# EAGLE design PCBMotores (EAGLE 7.6.0)
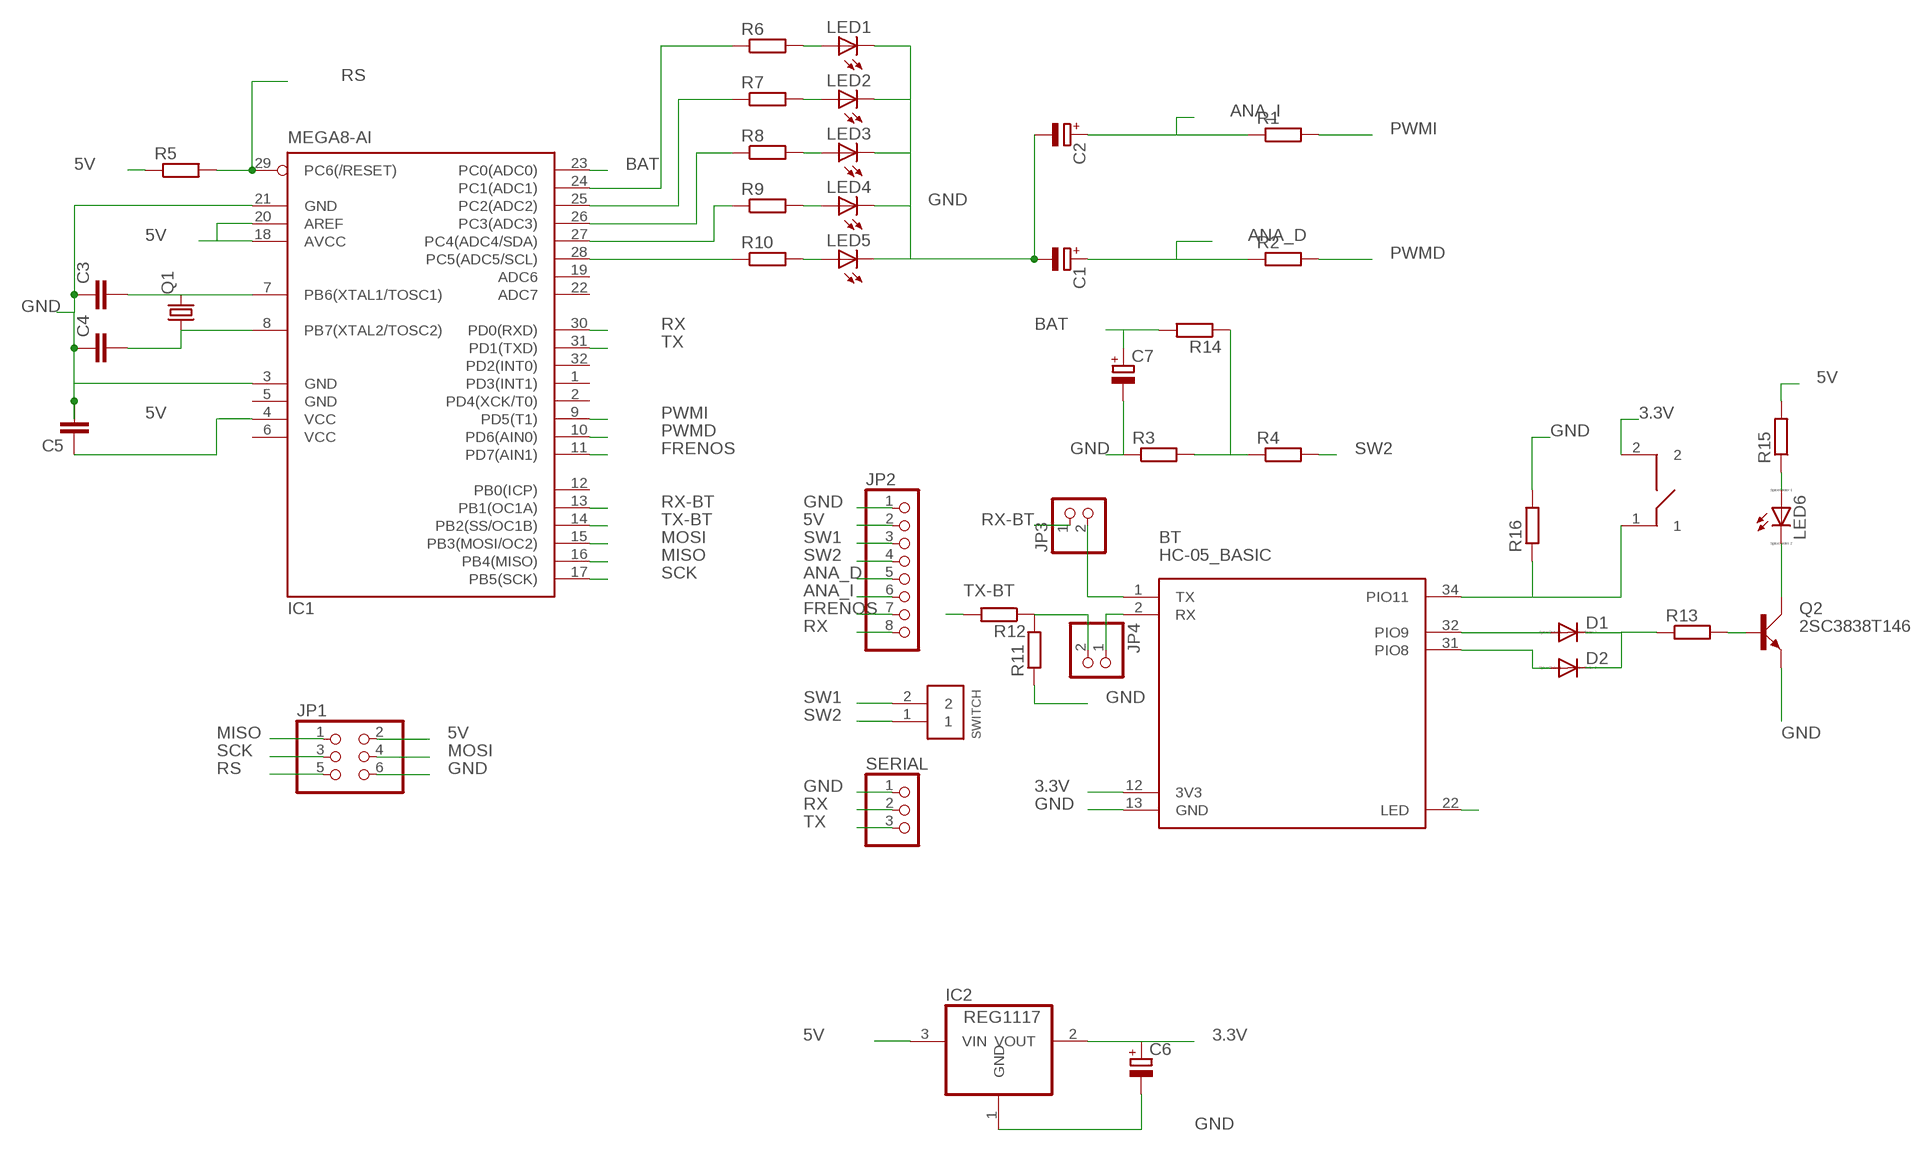
[diagram p0: schematic, sheet 1]

## Parts
BT  HC-05_BASIC  [BLUETOOTH_SMD]
C1  CPOL-EU153CLV-0505  [153CLV-0505]
C2  CPOL-EU153CLV-0505  [153CLV-0505]
C3  C-EUC0402K  [C0402K]
C4  C-EUC0402K  [C0402K]
C5  C-EUC0402K  [C0402K]
C6  CPOL-EU153CLV-0505  [153CLV-0505]
C7  CPOL-EU153CLV-0505  [153CLV-0505]
D1  DIODE-DO-214AC  [DO-214AC]
D2  DIODE-DO-214AC  [DO-214AC]
IC1  MEGA8-AI  [TQFP32-08]
IC2  REG1117  [SOT223]
JP1  PINHD-2X3  [2X03]
JP2  PINHD-1X8  [1X08]
JP3  PINHD-1X2  [1X02]
JP4  PINHD-1X2  [1X02]
LED1  LED5MM  [LED5MM]
LED2  LED5MM  [LED5MM]
LED3  LED5MM  [LED5MM]
LED4  LED5MM  [LED5MM]
LED5  LED5MM  [LED5MM]
LED6  LED_ESML0603  [LED_SML0603]
Q1  CRYSTALHC49S  [HC49/S]
Q2  2SC3838T146  [SC59]
R1  R-EU_M1206  [M1206]
R2  R-EU_M1206  [M1206]
R3  R-EU_M1206  [M1206]
R4  R-EU_M1206  [M1206]
R5  R-EU_M1206  [M1206]
R6  R-EU_M1206  [M1206]
R7  R-EU_M1206  [M1206]
R8  R-EU_M1206  [M1206]
R9  R-EU_M1206  [M1206]
R10  R-EU_M1206  [M1206]
R11  R-EU_M1206  [M1206]
R12  R-EU_M1206  [M1206]
R13  R-EU_M1206  [M1206]
R14  R-EU_M1206  [M1206]
R15  R-EU_M1206  [M1206]
R16  R-EU_M1206  [M1206]
SERIAL  PINHD-1X3  [1X03]
SWITCH  CP150_1X2  [CP150_1X2]
U$2  PUSH_SMD  [PUSH_SMD]

## Nets
3.3V: BT.12(3V3) C6.+ IC2.2(VOUT) U$2.2
5V: C5.1 IC1.4(VCC) IC1.18(AVCC) IC1.20(AREF) IC2.3(VIN) JP1.2 JP2.2 R5.1 R15.2
ANA_D: C1.+ JP2.5 R2.1
ANA_I: C2.+ JP2.6 R1.1
BAT: C7.+ IC1.23(PC0(ADC0)) R14.2
FRENOS: IC1.11(PD7(AIN1)) JP2.7
GND: BT.13(GND) C1.- C2.- C3.1 C4.1 C5.2 C6.- C7.- IC1.3(GND) IC1.21(GND) IC2.1(GND) JP1.6 JP2.1 LED1.K(C) LED2.K(C) LED3.K(C) LED4.K(C) LED5.K(C) Q2.E R3.1 R11.1 R16.2 SERIAL.1
MISO: IC1.16(PB4(MISO)) JP1.1
MOSI: IC1.15(PB3(MOSI/OC2)) JP1.4
N$3: IC1.28(PC5(ADC5/SCL)) R10.1
N$4: IC1.27(PC4(ADC4/SDA)) R9.1
N$5: IC1.26(PC3(ADC3)) R8.1
N$6: C4.2 IC1.8(PB7(XTAL2/TOSC2)) Q1.1
N$7: C3.2 IC1.7(PB6(XTAL1/TOSC1)) Q1.2
N$8: IC1.25(PC2(ADC2)) R7.1
N$9: IC1.24(PC1(ADC1)) R6.1
N$10: LED1.A R6.2
N$11: LED2.A R7.2
N$12: LED3.A R8.2
N$13: LED4.A R9.2
N$14: LED5.A R10.2
N$15: D1.C D2.C R13.1
N$16: Q2.B R13.2
N$17: BT.34(PIO11) R16.1 U$2.1
N$18: BT.32(PIO9) D1.A
N$19: BT.31(PIO8) D2.A
N$20: BT.22(LED)
N$21: LED6.A R15.1
N$22: LED6.C Q2.C
N$23: JP4.2 R11.2 R12.1
N$24: BT.1(TX) JP3.2
N$25: BT.2(RX) JP4.1
N$26: R3.2 R4.1 R14.1
PWMD: IC1.10(PD6(AIN0)) R2.2
PWMI: IC1.9(PD5(T1)) R1.2
RS: IC1.29(PC6(/RESET)) JP1.5 R5.2
RX: IC1.30(PD0(RXD)) JP2.8 SERIAL.2
RX-BT: IC1.13(PB1(OC1A)) JP3.1
SCK: IC1.17(PB5(SCK)) JP1.3
SW1: JP2.3 SWITCH.2
SW2: JP2.4 R4.2 SWITCH.1
TX: IC1.31(PD1(TXD)) SERIAL.3
TX-BT: IC1.14(PB2(SS/OC1B)) R12.2
Unconnected: IC1.1(PD3(INT1)) IC1.2(PD4(XCK/T0)) IC1.12(PB0(ICP)) IC1.19(ADC6) IC1.22(ADC7) IC1.32(PD2(INT0))

## Power pins joined to a net without a drawn wire
GND: IC1.5(GND)
VCC: IC1.6(VCC)

## Library data of the parts
BT = hc05-own:HC-05_BASIC
C1 C2 C6 C7 = rcl:CPOL-EU: POLARIZED CAPACITOR, European symbol
C3-C5 = rcl:C-EU: CAPACITOR, European symbol
D1 D2 = diode:DIODE-: DIODE
IC1 = atmel:MEGA8: MICROCONTROLLER 8 Kbytes FLASH, 1 kbytes SRAM, 512 bytes EEPROM, USART, 6-channel 10 bit ADC, 2-channel 8 bit ADC Pin compatible with Atmega48, ATMega88, ATMega168 Source: avr.lbr; MPN: ATMEGA8-16AU; OC_FARNELL: 9171371; OC_NEWARK: 73M8863
IC2 = burr-brown:REG1117: 800mA and 1A Low Dropout (LDO) Positive Regulator 1.8V, 2.5V, 2.85V, 3.3V, 5V, and Adj; MPN: REG1117; OC_FARNELL: 1097566; OC_NEWARK: 14P6981
JP1 = pinhead:PINHD-2X3: PIN HEADER
JP2 = pinhead:PINHD-1X8: PIN HEADER
JP3 JP4 = pinhead:PINHD-1X2: PIN HEADER
LED1-LED5 = led:LED: LED OSRAM: - CHIPLED LG R971, LG N971, LY N971, LG Q971, LY Q971, LO R971, LY R971 LH N974, LH R974 LS Q976, LO Q976, LY Q976 LO Q996 - Hyper CHIPLED LW Q18S LB Q993, LB Q99A, LB R99A - SideLED LS A670, LO A670, LY A670, LG A670, LP A670 LB A673, LV A673, LT A673, LW A673 LH A674 LY A675 LS A676, LA A676, LO A676, LY A676, LW A676 LS A679, LY A679, LG A679 - Hyper Micro SIDELED® LS Y876, LA Y876, LO Y876, LY Y876 LT Y87S - SmartLED LW L88C, LW L88S LB L89C, LB L89S, LG L890 LS L89K, LO L89K, LY L89K LS L896, LA L896, LO L896, LY L896 - TOPLED LS T670, LO T670, LY T670, LG T670, LP T670 LSG T670, LSP T670, LSY T670, LOP T670, LYG T670 LG T671, LOG T671, LSG T671 LB T673, LV T673, LT T673, LW T673 LH T674 LS T676, LA T676, LO T676, LY T676, LB T676, LH T676, LSB T676, LW T676 LB T67C, LV T67C, LT T67C, LS T67K, LO T67K, LY T67K, LW E67C LS E67B, LA E67B, LO E67B, LY E67B, LB E67C, LV E67C, LT E67C LW T67C LS T679, LY T679, LG T679 LS T770, LO T770, LY T770, LG T770, LP T770 LB T773, LV T773, LT T773, LW T773 LH T774 LS E675, LA E675, LY E675, LS T675 LS T776, LA T776, LO T776, LY T776, LB T776 LHGB T686 LT T68C, LB T68C - Hyper Mini TOPLED® LB M676 - Mini TOPLED Santana® LG M470 LS M47K, LO M47K, LY M47K Source: http://www.osram.convergy.de LUXEON: - LUMILED® LXK2-PW12-R00, LXK2-PW12-S00, LXK2-PW14-U00, LXK2-PW14-V00 LXK2-PM12-R00, LXK2-PM12-S00, LXK2-PM14-U00 LXK2-PE12-Q00, LXK2-PE12-R00, LXK2-PE12-S00, LXK2-PE14-T00, LXK2-PE14-U00 LXK2-PB12-K00, LXK2-PB12-L00, LXK2-PB12-M00, LXK2-PB14-N00, LXK2-PB14-P00, LXK2-PB14-Q00 LXK2-PR12-L00, LXK2-PR12-M00, LXK2-PR14-Q00, LXK2-PR14-R00 LXK2-PD12-Q00, LXK2-PD12-R00, LXK2-PD12-S00 LXK2-PH12-R00, LXK2-PH12-S00 LXK2-PL12-P00, LXK2-PL12-Q00, LXK2-PL12-R00 Source: www.luxeon.com KINGBRIGHT: KA-3528ASYC Source: www.kingbright.com
LED6 = eagle-ltspice:LED_E: LED Source: http://www.osram.convergy.de Source: www.luxeon.com Source: www.kingbright.com; SPICEMODEL: NONE; SPICEPREFIX: D; SPICETYPE: diode
Q1 = crystal:CRYSTAL: CRYSTAL; OC_FARNELL: 1667008; OC_NEWARK: unknown
Q2 = transistor-small-signal:2SC3838: High-Frequency Amplifier Transistor 11V, 50mA, 3.2GHz (Rohm)
R1-R16 = resistor:R-EU_: RESISTOR, European symbol
SERIAL = pinhead:PINHD-1X3: PIN HEADER
SWITCH = cp150:CP150_1X2
U$2 = push:PUSH_SMD

## Board
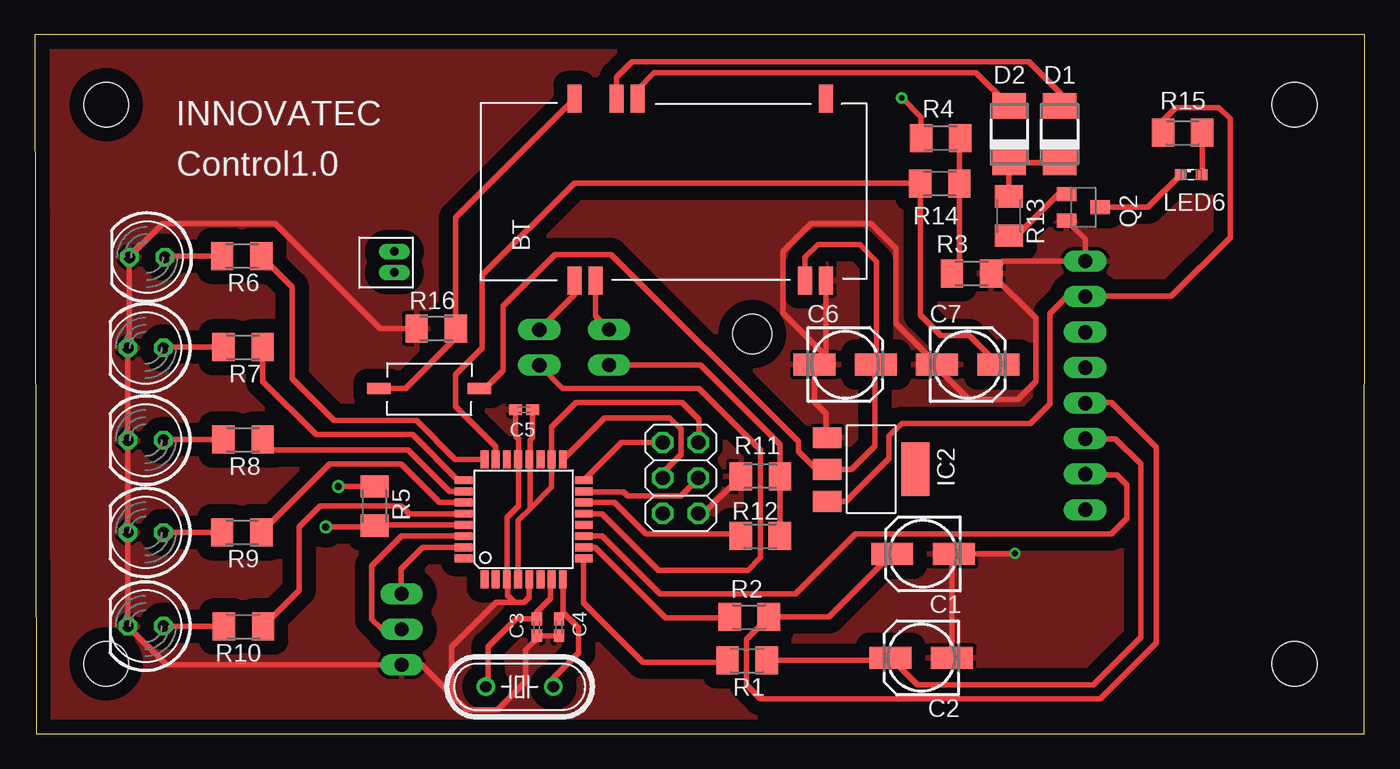
[diagram p1: board, top side]
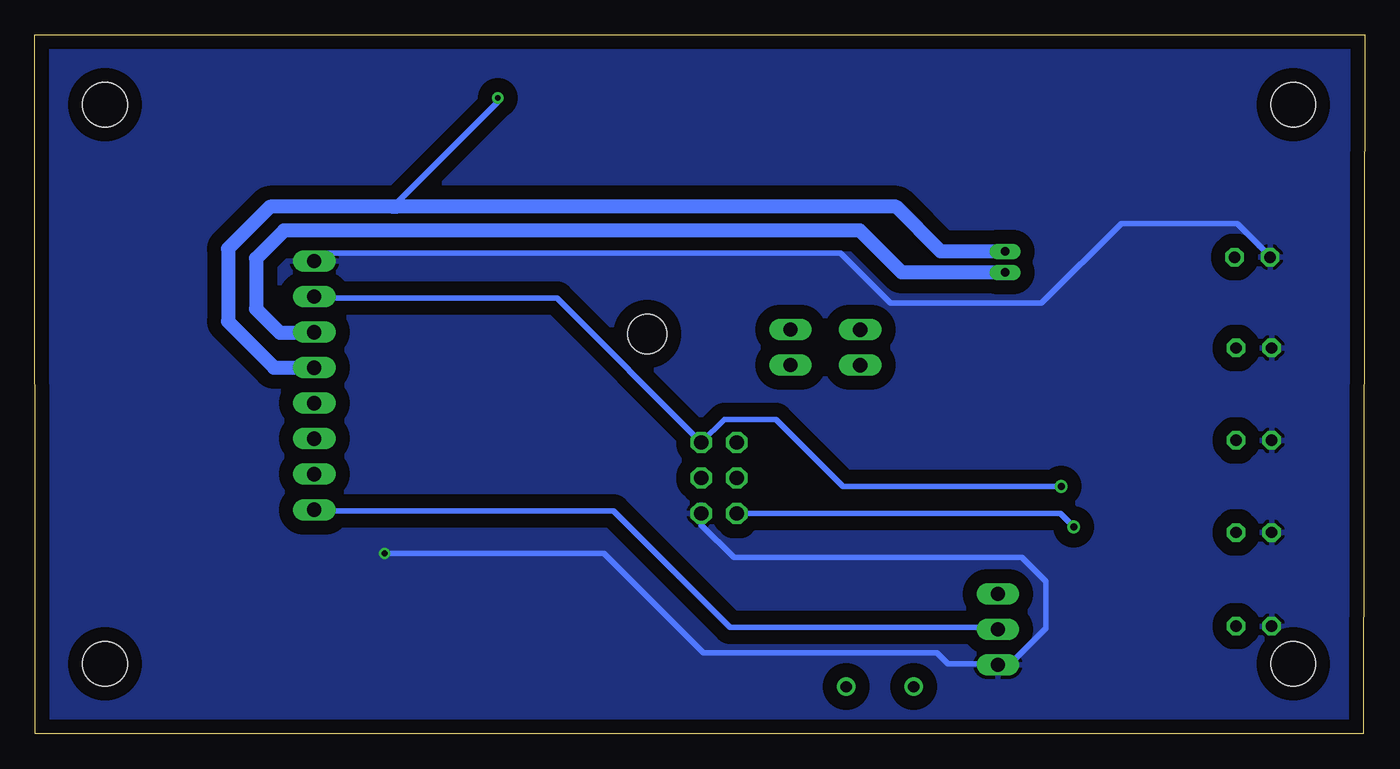
[diagram p2: board, bottom side, seen from below]

Size 95.11 x 50.01 mm. Coordinates in mm from the lower left corner, seen from the top.
Outline: 0.08,0 95.09,0 95.11,50.01 0,50.01 0.08,0
Copper layers (1*16): Top 0.035mm / dielectric 1.5mm / Bottom 0.035mm
Design rules "default": minimum track width 10mil, minimum drill 24mil, track to track 8mil, track to pad 8mil, pad to pad 8mil, via to via 8mil, smd to smd 8mil, copper to edge 40mil, drill to drill 8mil, minimum pad ring 10mil, minimum via ring 8mil, stop-mask expansion 4mil, vias tented up to drill 0mil, thermal gap 10mil
Holes 3.2 mm at 5.1,45.01 5.1,5.01 90.1,5.01 90.1,45.01
Holes 2.8 mm at 51.3,28.61

### Footprints (pad centres in the part's own frame; a part is rotated, then mirrored left to right if it is on the bottom)
BLUETOOTH_SMD = smd 2 x 1: 1 -6.35,3.81; 2 -6.35,2.31; 12 -6.35,-12.69; 13 -6.35,-14.19; 22 6.66,-14.19; 31 6.65,-0.69; 32 6.65,0.81; 34 6.65,3.81
153CLV-0505 = smd 3 x 1.6: + 2.2,0; - -2.2,0
C0402K = smd 0.925 x 0.74: 1 -0.6,0; 2 0.6,0
DO-214AC = smd 1.8 x 2.4: A 2.025,0; C -2.025,0
TQFP32-08 = smd 1.27 x 0.559: 1 -4.293,2.8; 2 -4.293,2; 3 -4.293,1.2; 4 -4.293,0.4; 5 -4.293,-0.4; 6 -4.293,-1.2; 7 -4.293,-2; 8 -4.293,-2.8; 17 4.293,-2.8; 18 4.293,-2; 19 4.293,-1.2; 20 4.293,-0.4; 21 4.293,0.4; 22 4.293,1.2; 23 4.293,2; 24 4.293,2.8 | smd 0.559 x 1.27: 9 -2.8,-4.293; 10 -2,-4.293; 11 -1.2,-4.293; 12 -0.4,-4.293; 13 0.4,-4.293; 14 1.2,-4.293; 15 2,-4.293; 16 2.8,-4.293; 25 2.8,4.293; 26 2,4.293; 27 1.2,4.293; 28 0.4,4.293; 29 -0.4,4.293; 30 -1.2,4.293; 31 -2,4.293; 32 -2.8,4.293
SOT223 = smd 1.499 x 2.007: 1 -2.261,-3.15; 2 0.025,-3.15; 3 2.311,-3.15 | smd 3.81 x 2.007: 4 0,3.15
2X03 = drill 1.016 octagon: 1 -2.54,-1.27; 2 -2.54,1.27; 3 0,-1.27; 4 0,1.27; 5 2.54,-1.27; 6 2.54,1.27
1X08 = drill 1.016 long: 1 -8.89,0; 2 -6.35,0; 3 -3.81,0; 4 -1.27,0; 5 1.27,0; 6 3.81,0; 7 6.35,0; 8 8.89,0
1X02 = drill 1.016 long: 1 -1.27,0; 2 1.27,0
LED5MM = drill 0.813 octagon: A -1.27,0; K 1.27,0
LED_SML0603 = smd 0.8 x 0.8: A 0.75,0; C -0.75,0
HC49/S = drill 0.813: 1 -2.413,0; 2 2.413,0
SC59 = smd 1 x 1.4: B -0.95,-1.2; C 0,1.2; E 0.95,-1.2
M1206 = smd 1.6 x 2: 1 -1.4,0; 2 1.4,0
1X03 = drill 1.016 long: 1 -2.54,0; 2 0,0; 3 2.54,0
CP150_1X2 = drill 0.6 long: 1 -0.5,0; 2 1,0
PUSH_SMD = smd 1.676 x 0.813: 1 -3.4,-0.1; 2 3.8,-0.1

### Placement (x,y rotation side)
BT  42.4,38.79 90 top
C1  63.52,12.88 180 top
C2  63.4,5.44 180 top
C3  35.89,7.63 90 top
C4  37.49,7.63 90 top
C5  34.98,23.2 180 top
C6  57.96,26.43 0 top
C7  66.72,26.43 0 top
D1  73.3,42.91 90 top
D2  69.7,42.91 90 top
IC1  34.96,15.35 90 top
IC2  59.82,18.93 270 top
JP1  46.18,18.31 270 top
JP2  75.13,24.93 270 top
JP3  36.08,27.65 90 top
JP4  41.07,27.66 270 top
LED1  8.02,34.11 180 top
LED2  7.92,27.61 180 top
LED3  7.92,21.01 180 top
LED4  7.92,14.41 180 top
LED5  7.92,7.71 180 top
LED6  82.7,40.01 0 top
Q1  34.67,3.37 180 top
Q2  74.99,37.68 270 top
R1  50.94,5.25 180 top
R2  51.09,8.37 180 top
R3  66.99,32.95 180 top
R4  64.79,42.63 180 top
R5  24.3,16.3 270 top
R6  14.79,34.19 180 top
R7  14.89,27.67 180 top
R8  14.89,21.05 180 top
R9  14.79,14.43 180 top
R10  14.92,7.69 180 top
R11  51.89,18.43 0 top
R12  51.88,14.15 180 top
R13  69.67,37.05 270 top
R14  64.73,39.38 180 top
R15  82.1,43.01 180 top
R16  28.7,29.01 180 top
SERIAL  26.23,7.48 90 top
SWITCH  25.72,34.02 270 top
U$2  28,24.81 0 top

### Tracks (layer width: path | path; a pad name or v marks a point on that pad's centre or on a via)
3.3V
  Top 0.406: BT.12 55.09,34.1 56,35.01 59,35.01 60.2,33.81 60.2,26.47 C6.+ 60.1,26.37 60.1,20.61 58.4,18.91 IC2.2 56.58,18.81 56,18.81 54.6,20.21 54.6,20.91 41.2,34.31 37.2,34.31 33.5,30.61 33.5,26.01 32.2,24.71 U$2.2
5V  (via drill 0.5)
  Top 0.406: IC1.4 34.56,15.27 35.4,16.11 | 35.4,16.11 35.4,19.6 IC1.20 35.4,19.68 35.4,21.01 35.58,21.19 C5.1 | 35.4,16.11 36.96,17.67 IC1.18 36.96,21.97 38.7,23.71 46.3,23.71 47.5,22.51 47.5,20.9 JP1.2 | R5.1 v21.71,17.7 v21.7,17.71 | IC2.3 58.01,16.62 61.1,19.71 61.1,21.31 62,22.21 71.2,22.21 72.6,23.61 72.6,30.08 73.7,31.18 75.03,31.18 JP2.2 | 74.5,31.21 75.06,31.21 JP2.2 | R15.2 80.7,43.91 81.6,44.81 84.7,44.81 85.5,44.01 85.5,35.51 81.3,31.31 75.16,31.31 JP2.2
  Bottom 0.406: v21.7,17.71 37.3,17.71 42.1,22.51 45.79,22.51 JP1.2 57.78,31.18 75.03,31.18 JP2.2
ANA_D
  Top 0.406: C1.+ 56.81,8.37 R2.1 50.9,6.78 50.9,3.51 51.9,2.51 76.2,2.51 80.2,6.51 80.2,20.51 77,23.71 75.18,23.71 JP2.5
ANA_I
  Top 0.406: R1.1 61.01,5.25 C2.+ 63.13,3.51 75.7,3.51 79.1,6.91 79.1,19.31 77.3,21.11 JP2.6
BAT
  Top 0.406: IC1.23 32.96,20.55 30.1,23.41 30.1,25.71 32,27.61 32,32.81 38.6,39.41 63.3,39.41 R14.2 63.33,29.98 64.8,28.51 66.84,28.51 C7.+
FRENOS
  Top 0.406: IC1.11 40.56,14.15 44.7,10.01 54.4,10.01 58.7,14.31 77,14.31 78.1,15.41 78.1,17.81 77.4,18.51 75.2,18.51 JP2.7
GND  (via drill 0.4)
  Top 0.406: IC1.5 35.36,9.77 35,9.41 34.3,9.41 | 34.3,9.41 33.8,9.91 33.8,11.02 IC1.3 33.76,15.47 34.6,16.31 34.6,19.6 IC1.21 34.6,19.68 34.6,21.11 34.38,21.33 C5.2 | C3.1 C4.1 36.12,7.03 35.1,6.01 35.1,3.71 33.1,1.71 30.9,1.71 29.8,2.81 | 29.8,2.81 29.8,6.21 33,9.41 34.3,9.41 | 29.8,2.81 27.67,4.94 SERIAL.1 9.42,4.94 LED5.K LED4.K LED3.K LED2.K 6.75,27.71 LED1.K 9.15,36.51 17.2,36.51 24.7,29.01 R16.2 | IC2.1 56.6,21.26 56.6,22.91 55.76,23.75 C6.- 56.47,27.14 | C2.- 65.6,12.76 C1.- 70.07,12.88 v70.1,12.91 | 56.47,27.14 56.59,27.26 BT.13 56.59,30.1 | JP1.6 47.83,15.77 R11.1 | Q2.E 75.13,35.39 JP2.1 69.26,33.82 R3.1 71.6,29.74 71.6,25.21 70.3,23.91 66.8,23.91 64.8,25.91 64.8,26.71 C7.- 61.6,29.35 61.6,34.71 59.8,36.51 55.5,36.51 53.5,34.51 53.5,30.11 56.47,27.14
  Bottom 0.406: JP1.6 47.45,14.96 45.1,12.61 24.5,12.61 22.8,10.91 22.8,7.54 25.4,4.94 SERIAL.1 26.3,5.01 29.8,5.01 30.6,5.81 47.3,5.81 54.4,12.91 v70.1,12.91 | LED1.K 6.75,34.16 9.1,36.51 17.4,36.51 23.1,30.81 33.9,30.81 37.5,34.41 74.54,34.41 JP2.1 74.64,34.31
  pour Bottom (isolate 1): 0.2,50.11 101.2,50.31 101.2,-0.49 0.3,-0.59
  pour Top (isolate 1): 0.9,50.01 102.3,49.81 102.3,-0.29 0.8,-0.29
MISO
  Top 0.406: JP1.1 41.95,20.85 IC1.16
MOSI
  Top 0.406: JP1.4 47.45,18.26 46.2,17.01 42.4,17.01 42.1,17.31 39.29,17.31 IC1.15
N$3
  Top 0.406: IC1.28 26.76,15.75 26.2,16.31 20.4,16.31 18.9,14.81 18.9,10.27 R10.1 16.34,7.71
N$4
  Top 0.406: IC1.27 28.96,16.55 26.2,19.31 21.07,19.31 R9.1
N$5
  Top 0.406: IC1.26 29.66,17.35 26.7,20.31 17.03,20.31 R8.1
N$6
  Top 0.406: IC1.8 37.76,8.71 | 37.76,8.71 37.76,8.5 C4.2 | Q1.1 37.08,3.99 38.9,5.81 38.9,7.57 37.76,8.71
N$7
  Top 0.406: IC1.7 36.9,11 36.9,9.71 35.89,8.7 C3.2 34.42,8.23 32.4,6.21 32.4,3.51 Q1.2
N$8
  Top 0.406: IC1.25 30.26,18.15 27,21.41 20.1,21.41 16.3,25.21 R7.1
N$9
  Top 0.406: IC1.24 30.07,19.64 27.3,22.41 21.4,22.41 18.4,25.41 18.4,31.98 R6.1
N$10
  Top 0.406: R6.2 9.37,34.19 LED1.A
N$11
  Top 0.406: R7.2 9.25,27.67 LED2.A
N$12
  Top 0.406: R8.2 9.23,21.05 LED3.A
N$13
  Top 0.406: R9.2 9.21,14.43 LED4.A
N$14
  Top 0.406: R10.2 9.21,7.69 LED5.A
N$15
  Top 0.406: R13.1 69.67,40.85 D2.C D1.C
N$16
  Top 0.406: Q2.B 73.22,38.63 70.2,35.61 69.71,35.61 R13.2
N$17
  Top 0.406: BT.34 30.1,36.95 R16.1 30.1,28.31 26.5,24.71 U$2.1
N$18
  Top 0.406: BT.32 41.59,47 42.7,48.11 71.1,48.11 73.4,45.81 73.4,45.03 D1.A
N$19
  Top 0.406: BT.31 43.09,46.1 44.3,47.31 67.32,47.31 D2.A
N$21
  Top 0.406: R15.1 83.5,40.06 LED6.A
N$22
  Top 0.406: Q2.C 79.62,37.68 LED6.C
N$23
  Top 0.406: R12.1 R11.2 53.3,20.71 47.62,26.39 JP4.2
N$24
  Top 0.406: BT.1 38.59,31.43 JP3.2
N$25
  Top 0.406: BT.2 40.09,29.91 JP4.1
N$26
  Top 0.406: R4.1 66.13,42.57 R14.1 66.13,33.49 R3.2
PWMD
  Top 0.406: IC1.10 40.06,13.35 45.1,8.31 49.63,8.31 R2.2
PWMI
  Top 0.406: IC1.9 39.25,9.36 43.5,5.11 49.4,5.11 R1.2
RS  (via drill 0.5)
  Top 0.406: IC1.29 24.35,14.95 R5.2 24.21,14.81 v20.8,14.81
  Bottom 0.406: JP1.5 21.76,15.77 v20.8,14.81
RX
  Top 0.406: IC1.30 26.24,14.15 24.1,12.01 24.1,8.21 24.8,7.51 26.2,7.51 SERIAL.2
  Bottom 0.406: SERIAL.2 26.36,7.61 45.4,7.61 53.73,15.94 75.03,15.94 JP2.8
RX-BT
  Top 0.406: IC1.13 40.56,15.75 44.6,11.71 51,11.71 51.9,12.61 51.9,20.31 47.5,24.71 37.75,24.71 JP3.1
SCK
  Top 0.406: JP1.3 44.91,18.72 46.2,20.01 46.2,21.81 45.4,22.61 40.73,22.61 IC1.17
SW1
  Bottom 1.016: SWITCH.2 33.11,33.02 36.1,36.01 77.3,36.01 79.3,34.01 79.3,30.41 77.6,28.71 75.16,28.71 JP2.3
SW2  (via drill 0.4)
  Top 0.406: R4.2 63.39,44.12 v62,45.51
  Bottom 0.406: v62,45.51 62,45.21 69.5,37.71
  Bottom 1.016: SWITCH.1 30.31,34.52 33.5,37.71 69.3,37.71 69.5,37.71 78.3,37.71 81.3,34.71 81.3,29.51 78,26.21 JP2.4
TX
  Top 0.406: IC1.31 27.74,13.35 26.2,11.81 26.2,10.05 SERIAL.3
TX-BT
  Top 0.406: IC1.14 41.46,16.55 43.7,14.31 50.32,14.31 R12.2

### Text on the board
tPlace: INNOVATEC | Control1.0